# Altium schematic sheet struct.SchDoc
size 594 x 420 mm; CompanyName: БГУИР, 750701; SheetNumber: 2; SheetTotal: 2; Разраб.: Шемпель; Пров.: Смирнова
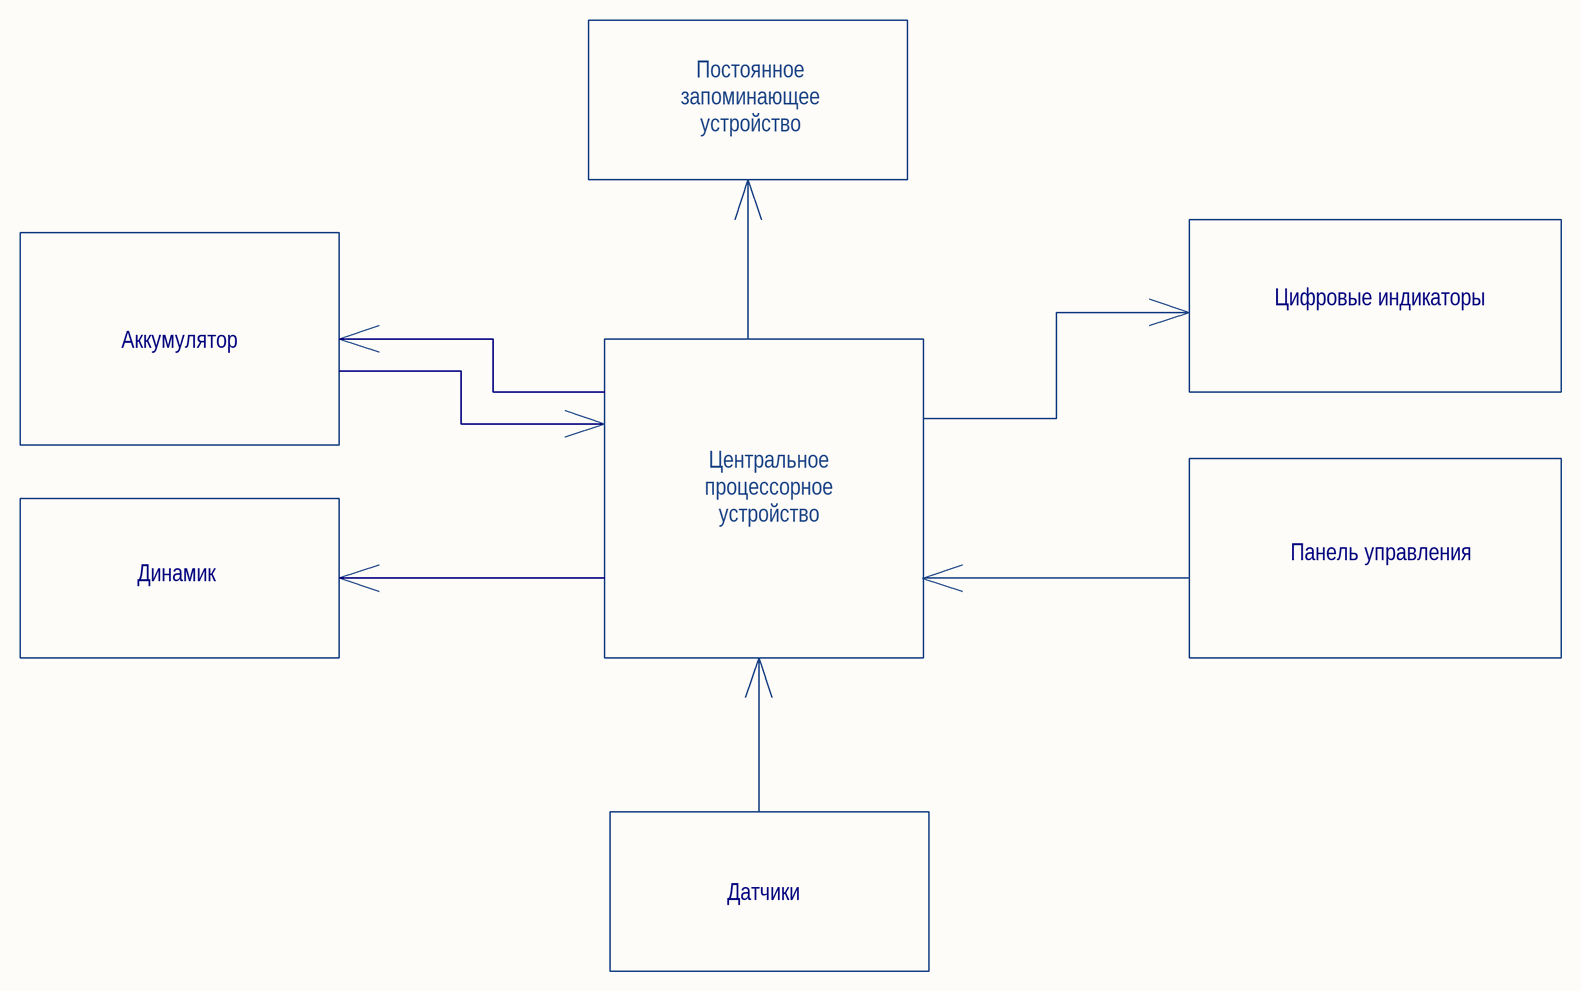
[diagram p0: struct.SchDoc]

## Notes on the sheet
- Постоянное запоминающее устройство
- Аккумулятор
- Цифровые индикаторы
- Центральное процессорное устройство
- Панель управления
- Динамик
- Датчики
- Перв. примен.
- Справ. №
- Подп. и дата
- Инв. № дубл.
- Взам. инв. №
- Разраб.
- Изм.
- Лист
- № докум.
- Подп.
- Дата
- Лит.
- Масса
- Масштаб
- Пров.
- Т.контр.
- Листов
- Инв. № подл.
- Утв.
- Н.контр.
- Копировал
- Формат А2